# Altium schematic sheet MCU025A_F280049C_Device.SchDoc
size 431 x 279 mm; Date: Not shown in title block; ApprovedBy: Not shown in title block; CheckedBy: Not shown in title block; Author: Not shown in title block; CompanyName: Not shown in title block; Engineer: Not shown in title block; Organization: Not shown in title block; Address1: Not shown in title block; Address2: Not shown in title block; Address3: Not shown in title block; Address4: Not shown in title block; DocumentNumber: 4; Revision: Use project parameter SCH_Rev; SheetNumber: 4; SheetTotal: 8; PageSetup: Record=PageOptions|CenterHorizontal=True|CenterVertical=True|PrintScale=1.00|XCorrection=1.00|YCorrection=1.00|PrintKind=0|BorderSize=5000000|LeftOffset=0|BottomOffset=0|Orientation=2|PaperLength=1000|PaperWidth=1000|Scale=100|PaperSource=15|PrintQuality=600|MediaType=1|DitherType=10|PaperKind=Letter|PrintScaleMode=1; CurrentTime: Not shown in title block; CurrentDate: Not shown in title block; Time: Not shown in title block; DocumentFullPathAndName: Not shown in title block; DocumentName: Not shown in title block; ModifiedDate: Not shown in title block; ImagePath: Not shown in title block
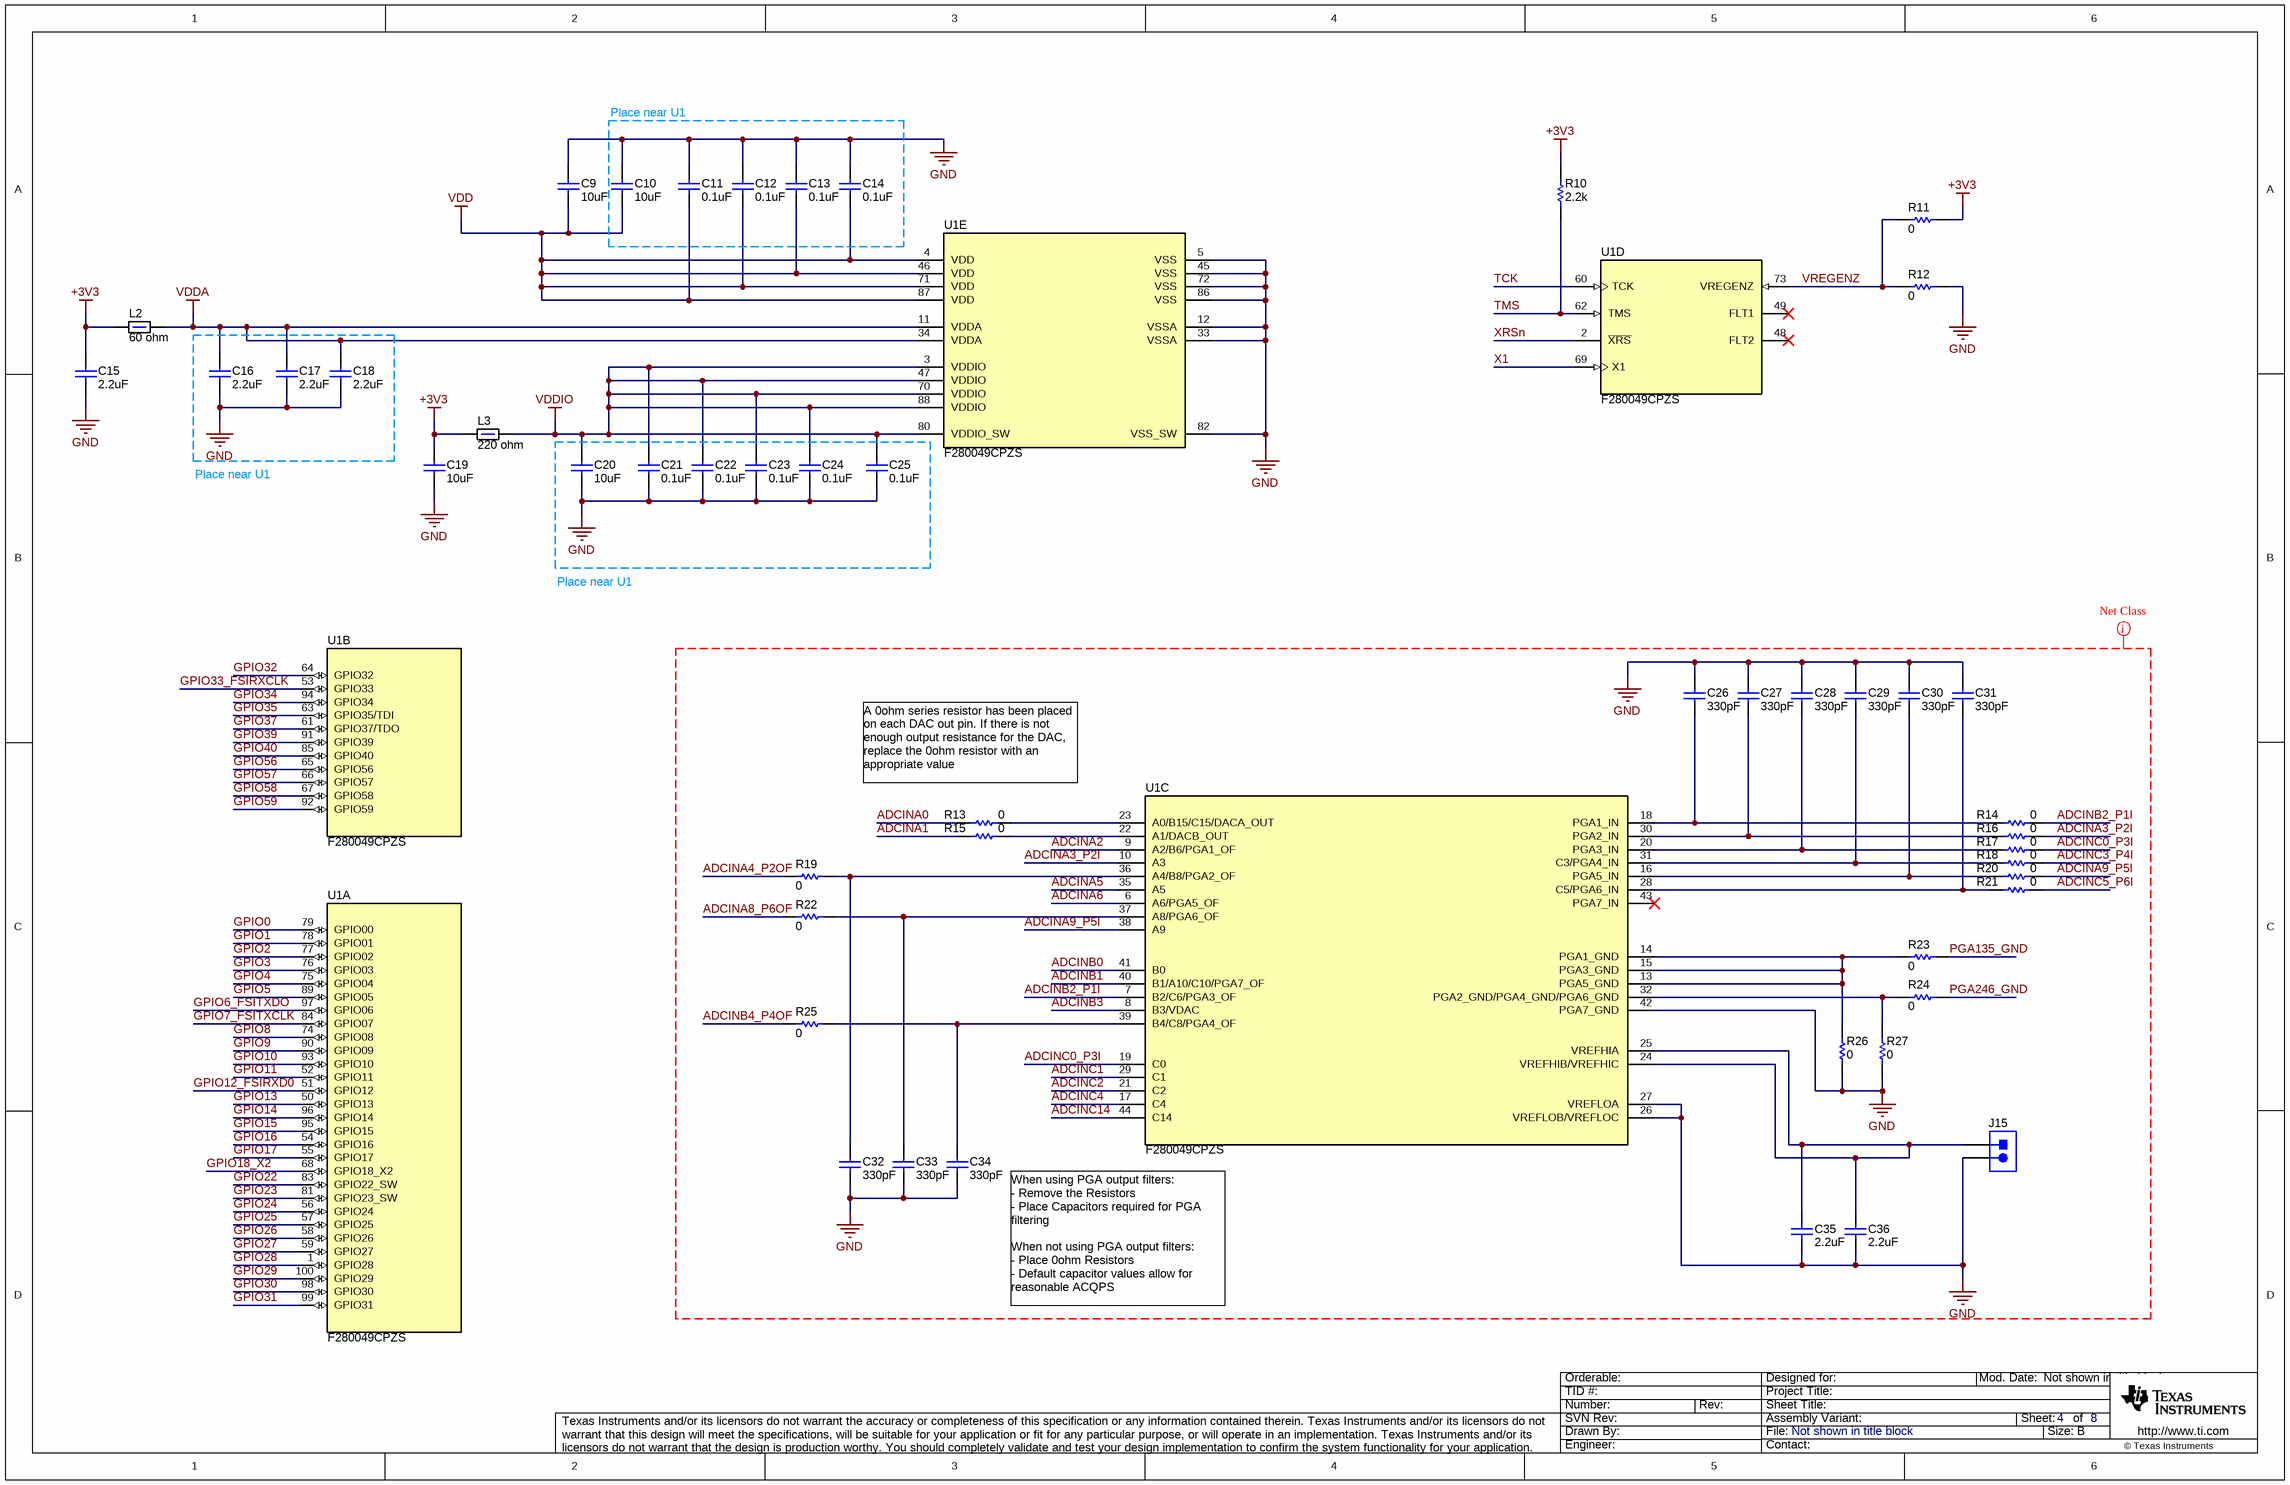
[diagram p0: MCU025A_F280049C_Device.SchDoc]

## Parts
C9  ValueDisplayed: 10uF  [0603]  (hidden comment: GRM188R61A106ME69D)
C10  ValueDisplayed: 10uF  [0603]  (hidden comment: GRM188R61A106ME69D)
C11  ValueDisplayed: 0.1uF  [0402]  (hidden comment: GRM155R71A104KA01D)
C12  ValueDisplayed: 0.1uF  [0402]  (hidden comment: GRM155R71A104KA01D)
C13  ValueDisplayed: 0.1uF  [0402]  (hidden comment: GRM155R71A104KA01D)
C14  ValueDisplayed: 0.1uF  [0402]  (hidden comment: GRM155R71A104KA01D)
C15  ValueDisplayed: 2.2uF  [0603]  (hidden comment: GRM188R61A225KE34D)
C16  ValueDisplayed: 2.2uF  [0603]  (hidden comment: GRM188R61A225KE34D)
C17  ValueDisplayed: 2.2uF  [0603]  (hidden comment: GRM188R61A225KE34D)
C18  ValueDisplayed: 2.2uF  [0603]  (hidden comment: GRM188R61A225KE34D)
C19  ValueDisplayed: 10uF  [0603]  (hidden comment: GRM188R61A106ME69D)
C20  ValueDisplayed: 10uF  [0603]  (hidden comment: GRM188R61A106ME69D)
C21  ValueDisplayed: 0.1uF  [0402]  (hidden comment: GRM155R71A104KA01D)
C22  ValueDisplayed: 0.1uF  [0402]  (hidden comment: GRM155R71A104KA01D)
C23  ValueDisplayed: 0.1uF  [0402]  (hidden comment: GRM155R71A104KA01D)
C24  ValueDisplayed: 0.1uF  [0402]  (hidden comment: GRM155R71A104KA01D)
C25  ValueDisplayed: 0.1uF  [0402]  (hidden comment: GRM155R71A104KA01D)
C26  ValueDisplayed: 330pF  [0603]  (hidden comment: GRM1885C1H331JA01D)
C27  ValueDisplayed: 330pF  [0603]  (hidden comment: GRM1885C1H331JA01D)
C28  ValueDisplayed: 330pF  [0603]  (hidden comment: GRM1885C1H331JA01D)
C29  ValueDisplayed: 330pF  [0603]  (hidden comment: GRM1885C1H331JA01D)
C30  ValueDisplayed: 330pF  [0603]  (hidden comment: GRM1885C1H331JA01D)
C31  ValueDisplayed: 330pF  [0603]  (hidden comment: GRM1885C1H331JA01D)
C32  ValueDisplayed: 330pF  [0603]  (hidden comment: GRM1885C1H331JA01D)
C33  ValueDisplayed: 330pF  [0603]  (hidden comment: GRM1885C1H331JA01D)
C34  ValueDisplayed: 330pF  [0603]  (hidden comment: GRM1885C1H331JA01D)
C35  ValueDisplayed: 2.2uF  [0603]  (hidden comment: GRM188R61A225KE34D)
C36  ValueDisplayed: 2.2uF  [0603]  (hidden comment: GRM188R61A225KE34D)
J15  61300211121  [WURTH_61300211121]  (value not drawn)
L2  ValueDisplayed: 60 ohm  [0805]  (hidden comment: BKP2125HS600-T)
L3  ValueDisplayed: 220 ohm  [0805]  (hidden comment: BLM21PG221SN1D)
R10  ValueDisplayed: 2.2k  [0402]  (hidden comment: CRCW04022K20JNED)
R11  ValueDisplayed: 0  [0603]  (hidden comment: CRCW06030000Z0EA)
R12  ValueDisplayed: 0  [0603]  (hidden comment: CRCW06030000Z0EA)
R13  ValueDisplayed: 0  [0603]  (hidden comment: CRCW06030000Z0EA)
R14  ValueDisplayed: 0  [0603]  (hidden comment: CRCW06030000Z0EA)
R15  ValueDisplayed: 0  [0603]  (hidden comment: CRCW06030000Z0EA)
R16  ValueDisplayed: 0  [0603]  (hidden comment: CRCW06030000Z0EA)
R17  ValueDisplayed: 0  [0603]  (hidden comment: CRCW06030000Z0EA)
R18  ValueDisplayed: 0  [0603]  (hidden comment: CRCW06030000Z0EA)
R19  ValueDisplayed: 0  [0603]  (hidden comment: CRCW06030000Z0EA)
R20  ValueDisplayed: 0  [0603]  (hidden comment: CRCW06030000Z0EA)
R21  ValueDisplayed: 0  [0603]  (hidden comment: CRCW06030000Z0EA)
R22  ValueDisplayed: 0  [0603]  (hidden comment: CRCW06030000Z0EA)
R23  ValueDisplayed: 0  [0603]  (hidden comment: CRCW06030000Z0EA)
R24  ValueDisplayed: 0  [0603]  (hidden comment: CRCW06030000Z0EA)
R25  ValueDisplayed: 0  [0603]  (hidden comment: CRCW06030000Z0EA)
R26  ValueDisplayed: 0  [0603]  (hidden comment: CRCW06030000Z0EA)
R27  ValueDisplayed: 0  [0603]  (hidden comment: CRCW06030000Z0EA)
U1  F280049CPZS  [PZ0100A_N]  (parts A,B,C,D,E of 5)

## Nets
+3V3: C15.1 C19.1 L2.1 L3.1 R10.2 R11.2
GND: C9.1 C10.1 C11.2 C12.2 C13.2 C14.2 C15.2 C16.2 C17.2 C18.2 C19.2 C20.2 C21.1 C22.1 C23.1 C24.1 C25.1 C26.1 C27.1 C28.1 C29.1 C30.1 C31.1 C32.2 C33.2 C34.2 C35.2 C36.2 J15.2 R12.2 R26.1 R27.1 U1.5(VSS) U1.12(VSSA) U1.26(VREFLOB/VREFLOC) U1.27(VREFLOA) U1.33(VSSA) U1.42(PGA7_GND) U1.45(VSS) U1.72(VSS) U1.82(VSS_SW) U1.86(VSS)
VDD: C9.2 C10.2 C11.1 C12.1 C13.1 C14.1 U1.4(VDD) U1.46(VDD) U1.71(VDD) U1.87(VDD)
VDDA: C16.1 C17.1 C18.1 L2.2 U1.11(VDDA) U1.34(VDDA)
VDDIO: C20.1 C21.2 C22.2 C23.2 C24.2 C25.2 L3.2 U1.3(VDDIO) U1.47(VDDIO) U1.70(VDDIO) U1.80(VDDIO_SW) U1.88(VDDIO)
ADCINA0: R13.1
ADCINA1: R15.1
ADCINA2: U1.9(A2/B6/PGA1_OF)
ADCINA3_P2I: R16.2 U1.10(A3)
ADCINA4_P2OF: R19.1
ADCINA5: U1.35(A5)
ADCINA6: U1.6(A6/PGA5_OF)
ADCINA8_P6OF: R22.1
ADCINA9_P5I: R20.2 U1.38(A9)
ADCINB0: U1.41(B0)
ADCINB1: U1.40(B1/A10/C10/PGA7_OF)
ADCINB2_P1I: R14.2 U1.7(B2/C6/PGA3_OF)
ADCINB3: U1.8(B3/VDAC)
ADCINB4_P4OF: R25.1
ADCINC0_P3I: R17.2 U1.19(C0)
ADCINC1: U1.29(C1)
ADCINC2: U1.21(C2)
ADCINC3_P4I: R18.2
ADCINC4: U1.17(C4)
ADCINC5_P6I: R21.2
ADCINC14: U1.44(C14)
GPIO0: U1.79(GPIO00)
GPIO1: U1.78(GPIO01)
GPIO2: U1.77(GPIO02)
GPIO3: U1.76(GPIO03)
GPIO4: U1.75(GPIO04)
GPIO5: U1.89(GPIO05)
GPIO6_FSITXDO: U1.97(GPIO06)
GPIO7_FSITXCLK: U1.84(GPIO07)
GPIO8: U1.74(GPIO08)
GPIO9: U1.90(GPIO09)
GPIO10: U1.93(GPIO10)
GPIO11: U1.52(GPIO11)
GPIO12_FSIRXD0: U1.51(GPIO12)
GPIO13: U1.50(GPIO13)
GPIO14: U1.96(GPIO14)
GPIO15: U1.95(GPIO15)
GPIO16: U1.54(GPIO16)
GPIO17: U1.55(GPIO17)
GPIO18_X2: U1.68(GPIO18_X2)
GPIO22: U1.83(GPIO22_SW)
GPIO23: U1.81(GPIO23_SW)
GPIO24: U1.56(GPIO24)
GPIO25: U1.57(GPIO25)
GPIO26: U1.58(GPIO26)
GPIO27: U1.59(GPIO27)
GPIO28: U1.1(GPIO28)
GPIO29: U1.100(GPIO29)
GPIO30: U1.98(GPIO30)
GPIO31: U1.99(GPIO31)
GPIO32: U1.64(GPIO32)
GPIO33_FSIRXCLK: U1.53(GPIO33)
GPIO34: U1.94(GPIO34)
GPIO35: U1.63(GPIO35/TDI)
GPIO37: U1.61(GPIO37/TDO)
GPIO39: U1.91(GPIO39)
GPIO40: U1.85(GPIO40)
GPIO56: U1.65(GPIO56)
GPIO57: U1.66(GPIO57)
GPIO58: U1.67(GPIO58)
GPIO59: U1.92(GPIO59)
PGA135_GND: R23.2
PGA246_GND: R24.2
TCK: U1.60(TCK)
TMS: R10.1 U1.62(TMS)
VREGENZ: R11.1 R12.1 U1.73(VREGENZ)
X1: U1.69(X1)
XRSn: U1.2(~{XRS})
NetC26_2: C26.2 R14.1 U1.18(PGA1_IN)
NetC27_2: C27.2 R16.1 U1.30(PGA2_IN)
NetC28_2: C28.2 R17.1 U1.20(PGA3_IN)
NetC29_2: C29.2 R18.1 U1.31(C3/PGA4_IN)
NetC30_2: C30.2 R20.1 U1.16(PGA5_IN)
NetC31_2: C31.2 R21.1 U1.28(C5/PGA6_IN)
NetC32_1: C32.1 R19.2 U1.36(A4/B8/PGA2_OF)
NetC33_1: C33.1 R22.2 U1.37(A8/PGA6_OF)
NetC34_1: C34.1 R25.2 U1.39(B4/C8/PGA4_OF)
NetC35_1: C35.1 C36.1 J15.1 U1.24(VREFHIB/VREFHIC) U1.25(VREFHIA)
NetR13_2: R13.2 U1.23(A0/B15/C15/DACA_OUT)
NetR15_2: R15.2 U1.22(A1/DACB_OUT)
NetR23_1: R23.1 R26.2 U1.13(PGA5_GND) U1.14(PGA1_GND) U1.15(PGA3_GND)
NetR24_1: R24.1 R27.2 U1.32(PGA2_GND/PGA4_GND/PGA6_GND)

Not connected (* = marked no-connect by the designer): U1 43(PGA7_IN)* 48(FLT2)* 49(FLT1)*

## Layout directives
net class Analog: ADCINA0, ADCINA1, ADCINA2, ADCINA3_P2I, ADCINA4_P2OF, ADCINA5, ADCINA6, ADCINA8_P6OF, ADCINA9_P5I, ADCINB0, ADCINB1, ADCINB2_P1I, ADCINB3, ADCINB4_P4OF, ADCINC0_P3I, ADCINC1, ADCINC2, ADCINC3_P4I, ADCINC4, ADCINC5_P6I, ADCINC14, GND, PGA135_GND, PGA246_GND

## Notes on the sheet
- Place near U1
- A 0ohm series resistor has been placed on each DAC out pin. If there is not enough output resistance for the DAC, replace the 0ohm resistor with an appropriate value
- When using PGA output filters:
  - Remove the Resistors
  - Place Capacitors required for PGA filtering
  When not using PGA output filters:
  - Place 0ohm Resistors
  - Default capacitor values allow for reasonable ACQPS
- Drawn By:
- SVN Rev:
- Number:
- TID #:
- Orderable:
- Rev:
- Sheet Title:
- File:
- Project Title:
- Designed for:
- Assembly Variant:
- Mod. Date:
- Sheet:
- Size:
- of
- B
- http://www.ti.com
- Texas Instruments and/or its licensors do not warrant the accuracy or completeness of this specification or any information contained therein. Texas Instruments and/or its licensors do not warrant that this design will meet the specifications, will be suitable for your application or fit for any particular purpose, or will operate in an implementation. Texas Instruments and/or its licensors do not warrant that the design is production worthy. You should completely validate and test your design implementation to confirm the system functionality for your application.
- Engineer:
- Contact:
- © Texas Instruments

## Library data of the parts
C9 C10 C19 C20 = CMP-0007318-5: CAP, CERM, 10 uF, 10 V, +/- 20%, X5R, 0603; Manufacturer: MuRata; Polarized: N; Value: 10uF; U/M: EA; Cap_F: 10µF; Value1: Unknown; VDC_V: 10V; TaMin_C: -55°C; TaMax_C: 85°C; SizeArea_mm2: 1.28; SizeAreaWB_mm2: 4.68; SizeX_mm: 1.6; SizeY_mm: 0.8; SizeZ_mm: 1; AEC Category: Q200; CompType: Capacitor; PartNumber: GRM188R61A106ME69D; PackageReference: 0603; RoHS: Y; Tolerance_%: 20%; Value2: 10V; MountType: SMT; Technology: Ceramic; TempCo: X5R; Cap_Case: 0603; Published: 2008-06-19; Publisher: Texas Instruments; LatestRevisionDate: 2017-03-09; ComponentLink1Description: Datasheet link; ComponentLink1URL: http://psearch.murata.com/capacitor/product/GRM188R61A106ME69%23.pdf; AEC Qualified: ?
C11-C14 C21-C25 = CMP-0006629-2: CAP, CERM, 0.1 uF, 10 V, +/- 10%, X7R, 0402; Manufacturer: MuRata; Polarized: N; Value: 0.1uF; U/M: EA; Cap_F: 100nF; Value1: Unknown; VDC_V: 10V; TaMin_C: -55°C; TaMax_C: 125°C; SizeArea_mm2: 0.5; SizeAreaWB_mm2: 3; SizeX_mm: 1; SizeZ_mm: 0.6; AEC Category: Q200; CompType: Capacitor; PartNumber: GRM155R71A104KA01D; PackageReference: 0402; RoHS: Y; Tolerance_%: 10%; Value2: 10V; MountType: SMT; Technology: Ceramic; TempCo: X7R; Cap_Case: 0402; SizeY_mm: 0.5; Published: 2008-06-19; Publisher: Texas Instruments; LatestRevisionDate: 2017-03-09; ComponentLink1Description: Datasheet link; ComponentLink1URL: http://search.murata.co.jp/Ceramy/PnsearchViewAction.do?HnOFG=ON&HnNFG=ON&SEL_CNT=50&sLang=en&sKey=GRM155R71A104KA01D&x=9&y=9&search=startwith; Supplier 1: Digi-Key; Supplier Part Number 1: GRM155R71A104KA01D-ND; Supplier 2: Newark; Supplier Part Number 2: 14T3278; Supplier 3: Mouser; Supplier Part Number 3: 81-GRM155R71A104KA1D; AEC Qualified: ?
C15-C18 C35 C36 = CMP-0007323-5: CAP, CERM, 2.2 uF, 10 V, +/- 10%, X5R, 0603; Manufacturer: MuRata; Polarized: N; Value: 2.2uF; U/M: EA; Cap_F: 2.2µF; Value1: Unknown; VDC_V: 10V; TaMin_C: -55°C; TaMax_C: 85°C; SizeArea_mm2: 1.28; SizeAreaWB_mm2: 4.68; SizeX_mm: 1.6; SizeY_mm: 0.8; SizeZ_mm: 1; AEC Category: Q200; CompType: Capacitor; PartNumber: GRM188R61A225KE34D; PackageReference: 0603; RoHS: Y; Tolerance_%: 10%; Value2: 10V; MountType: SMT; Technology: Ceramic; TempCo: X5R; Cap_Case: 0603; Published: 2008-06-19; Publisher: Texas Instruments; LatestRevisionDate: 2017-03-09; ComponentLink1Description: Datasheet link; ComponentLink1URL: http://search.murata.co.jp/Ceramy/PnsearchViewAction.do?HnOFG=ON&HnNFG=ON&SEL_CNT=50&sLang=en&sKey=GRM188R61A225KE34D&x=9&y=9&search=startwith; Supplier 1: Digi-Key; Supplier Part Number 1: 490-1545-1-ND; Supplier 2: Mouser; Supplier Part Number 2: 81-GRM188R61A225KE34; Supplier 3: Farnell; Supplier Part Number 3: 1828799; AEC Qualified: ?
C26-C34 = CMP-0007209-4: CAP, CERM, 330 pF, 50 V, +/- 5%, C0G/NP0, 0603; Manufacturer: MuRata; Polarized: N; Value: 330pF; U/M: EA; Value1: Unknown; VDC_V: 50V; TaMin_C: -55°C; TaMax_C: 125°C; SizeArea_mm2: 1.28; SizeAreaWB_mm2: 4.68; SizeX_mm: 1.6; SizeY_mm: 0.8; SizeZ_mm: 1; AEC Category: Q200; CompType: Capacitor; PartNumber: GRM1885C1H331JA01D; PackageReference: 0603; RoHS: Y; Cap_F: 330pF; Tolerance_%: 5%; Value2: 50V; MountType: SMT; Technology: Ceramic; TempCo: C0G/NP0; Cap_Case: 0603; Published: 2008-06-19; Publisher: Texas Instruments; LatestRevisionDate: 2017-03-09; ComponentLink1Description: Datasheet link; ComponentLink1URL: http://search.murata.co.jp/Ceramy/PnsearchViewAction.do?HnOFG=ON&HnNFG=ON&SEL_CNT=50&sLang=en&sKey=GRM1885C1H331JA01D&x=9&y=9&search=startwith; Supplier 1: Digi-Key; Supplier Part Number 1: 490-1439-1-ND; Supplier 2: Mouser; Supplier Part Number 2: 81-GRM39C331J50; Supplier 3: Farnell; Supplier Part Number 3: 8819890; AEC Qualified: ?
J15 = CMP-0054794-1: Header, 2.54 mm, 2x1, Gold, TH; Manufacturer: Wurth Elektronik; Green_Lifecycle: Active; Green_REACh: Passed; CNHeader: TRUE; CT: FALSE; PartNumber: 61300211121; PackageReference: Header, 2.54mm, 2x1, TH; ClassName: Header; CompType: Header; RoHS: Y; MountType: TH; ComponentLink1Description: Datasheet URL; ComponentLink1URL: http://katalog.we-online.de/em/datasheet/6130xx11121.pdf; Publisher: Texas Instruments; LatestRevisionDate: 26/05/2017; Supplier 1: Digi-Key; Supplier Part Number 1: 732-5315-ND; Supplier 2: Newark; Supplier Part Number 2: 20X0948; Supplier 3: Mouser; Supplier Part Number 3: 710-61300211121; Green_EU RoHS: Passed; Green_EU RoHS-2: Incomplete
L2 = CMP-0003306-1: Ferrite Bead, 60 ohm @ 100 MHz, 3 A, 0805; Manufacturer: Taiyo Yuden; Value: 60 ohm; Imax_A: 3A; DCR_ohm: 0.025; Value1: 0.025 ohm; SizeAreaWB_mm2: 6.75; SizeArea_mm2: 2.5; SizeX_mm: 2; SizeY_mm: 1.25; SizeZ_mm: 1.45; ZTyp@100MHz_Ohm: 60; PartNumber: BKP2125HS600-T; CompType: Ferrite Bead; Value2: 3A; MountType: SMT; PackageReference: 0805; Published: 2014-04-30; Publisher: Texas Instruments; LatestRevisionDate: 2017-03-09; ComponentLink1Description: Datasheet link; ComponentLink1URL: http://www.yuden.co.jp/productdata/catalog/en/mlci08_e.pdf; RoHS: Y; Supplier 1: Digi-Key; Supplier Part Number 1: 587-1932-1-ND; Supplier 2: Newark; Supplier Part Number 2: 30K5394 LF BKP2125HS600-T; Supplier 3: Mouser; Supplier Part Number 3: 963-BKP2125HS600-T
L3 = CMP-0003363-1: Ferrite Bead, 220 ohm @ 100 MHz, 2 A, 0805; Manufacturer: MuRata; Value: 220 ohm; Imax_A: 2A; DCR_ohm: 0.045; Value1: 0.045 ohm; SizeAreaWB_mm2: 6.75; SizeArea_mm2: 2.5; SizeX_mm: 2; SizeY_mm: 1.25; SizeZ_mm: 1.45; ZTyp@100MHz_Ohm: 220; PartNumber: BLM21PG221SN1D; CompType: Ferrite Bead; Value2: 2A; MountType: SMT; PackageReference: 0805; Published: 2014-04-30; Publisher: Texas Instruments; LatestRevisionDate: 2017-03-09; ComponentLink1Description: Datasheet link; ComponentLink1URL: http://search.murata.co.jp/Ceramy/image/img/PDF/ENG/L0110S0100BLM21P.pdf; RoHS: Y; Supplier 1: Digi-Key; Supplier Part Number 1: 490-1054-1-ND; Supplier 2: Newark; Supplier Part Number 2: 73M9167; Supplier 3: Mouser; Supplier Part Number 3: 81-BLM21P221SG
R10 = CMP-0026890-5: RES, 2.2 k, 5%, 0.063 W, AEC-Q200 Grade 0, 0402; Manufacturer: Vishay-Dale; Value: 2.2k; Value_Code: 2k20; Power_W: 63mW; Value2: 0.063W; VDC_V: 50V; TempCo: 200 ppm/C; SizeArea_mm2: 0.5; SizeX_mm: 1; SizeZ_mm: 0.6; EIA_Code: E24; AEC Category: Q200; AEC Qualified: Y; AEC Grade: 0; CompType: Resistor; PartNumber: CRCW04022K20JNED; PackageReference: 0402; RoHS: E; Res_ohm: 2.2k; Tolerance_%: 5%; Value1: 5%; MountType: SMT; Technology: Thick Film; SizeY_mm: 0.5; ComponentLink1Description: Datasheet link; ComponentLink1URL: http://www.vishay.com/docs/20035/dcrcwe3.pdf; Supplier 1: Digi-Key; Supplier Part Number 1: 541-2.2KJCT-ND; Supplier 2: Newark; Supplier Part Number 2: 59M6710; Supplier 3: Mouser; Supplier Part Number 3: 71-CRCW0402J-2.2K-E3
R11-R27 = CMP-0025697-4: RES, 0, 5%, 0.1 W, AEC-Q200 Grade 0, 0603; Manufacturer: Vishay-Dale; Value: 0; Value_Code: 0000; Power_W: 100mW; Value2: 0.1W; VDC_V: 75V; TempCo: 200 ppm/C; SizeArea_mm2: 1.28; SizeX_mm: 1.6; SizeY_mm: 0.8; SizeZ_mm: 1; EIA_Code: E24; AEC Category: Q200; AEC Qualified: Y; CompType: Resistor; PartNumber: CRCW06030000Z0EA; PackageReference: 0603; RoHS: E; Res_ohm: 0; Tolerance_%: 5%; Value1: 5%; MountType: SMT; Technology: Thick Film; ComponentLink1Description: Datasheet link; ComponentLink1URL: http://www.vishay.com/docs/20035/dcrcwe3.pdf; Supplier 1: Digi-Key; Supplier Part Number 1: 541-0.0GCT-ND; Supplier 2: Newark; Supplier Part Number 2: 52K8014; Supplier 3: Mouser; Supplier Part Number 3: 71-CRCW0603-0-E3; AEC Grade: 0
U1 = CMP-0078352-1: Piccolo Microcontroller, PZ0100A (LQFP-100); Manufacturer: Texas Instruments; SizeZ_mm: 1.6; SizeX_mm: 16; AEC Category: Q200; AEC Qualified: N; SizeArea_mm2: 256; CompType: IC; SizeAreaWB_mm2: 324; ComponentLink1URL: http://www.ti.com/lit/ds/symlink/tms320f280049c.pdf; SizeY_mm: 16; PackageDescription: LQFP-100; ComponentLink2URL: http://www.ti.com/product/tms320f280049c; PackageReference: PZ0100A; ComponentLink2Description: Product Folder; PartNumber: F280049CPZS; MountType: SMT; ComponentLink1Description: Datasheet Link; Alternate Manufacturer: Texas Instruments; PartId: 1